# Altium schematic sheet STM32F407VG-F.SchDoc
size A4
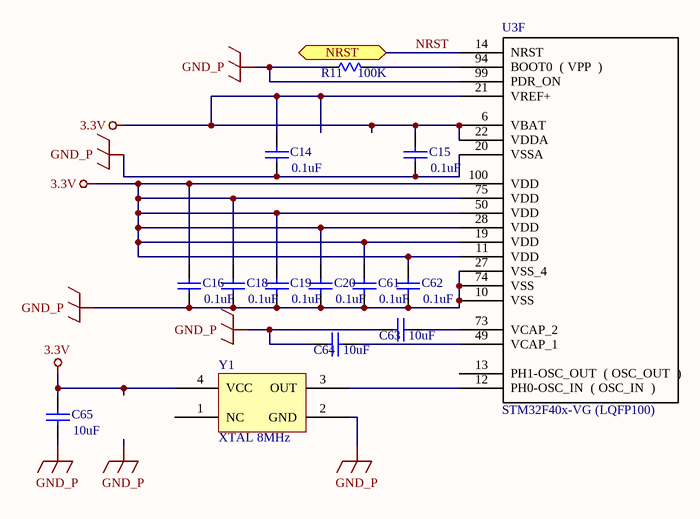
[diagram p0: STM32F407VG-F.SchDoc]

## Parts
C14  0.1uF  [C0603-S]
C15  0.1uF  [C0603-S]
C16  0.1uF  [C0603-S]
C18  0.1uF  [C0603-S]
C19  0.1uF  [C0603-S]
C20  0.1uF  [C0603-S]
C61  0.1uF  [C0603-S]
C62  0.1uF  [C0603-S]
C63  10uF  [C0603-S]
C64  10uF  [C0603-S]
C65  10uF  [C0603-S]
R11  100K  [R0603-S]
U3  STM32F40x-VG (LQFP100)  [LQFP100_N]  (part F of 6)
Y1  XTAL 8MHz  [XTAL 3.3X5.0S-SM]

## Ports
NRST (bidir)

## Nets
3.3V: C14.1 C15.1 C16.1 C18.1 C19.1 C20.1 C61.1 C62.1 C65.1 U3.6(VBAT) U3.11(VDD) U3.19(VDD) U3.21(VREF+) U3.22(VDDA) U3.28(VDD) U3.50(VDD) U3.75(VDD) U3.100(VDD) Y1.4(VCC)
GND_P: C14.2 C15.2 C16.2 C18.2 C19.2 C20.2 C61.2 C62.2 C63.1 C64.1 C65.2 R11.2 U3.10(VSS) U3.20(VSSA) U3.27(VSS_4) U3.74(VSS) U3.99(PDR_ON) Y1.2(GND)
NRST: U3.14(NRST) ; port NRST
NetC63_2: C63.2 U3.73(VCAP_2)
NetC64_2: C64.2 U3.49(VCAP_1)
NetR11_1: R11.1 U3.94(BOOT0__(_VPP__))
NetU3_12: U3.12(PH0-OSC_IN__(_OSC_IN__)) Y1.3(OUT)

Not connected (* = marked no-connect by the designer): U3 13(PH1-OSC_OUT__(_OSC_OUT__)); Y1 1(NC)

## Library data of the parts
C14-C16 C18-C20 C61-C65 = Cap: Capacitor; Published: 8-Jun-2000; Revision: July-2002: Re-released for DXP Platform.; Publisher: Altium Limited
  C14-C16 C18-C20 C61 C62: Value: 0.1uF
  C63-C65: Value: 10uF
R11 = Res: Resistor; Published: 8-Jun-2000; LatestRevisionDate: 04-Mar-2005; LatestRevisionNote: PCB Footprint replaced.; PackageReference: J1-0603; Publisher: Altium Limited; Value: 100K
U3 = STM32F40x-VG
Y1 = XTAL